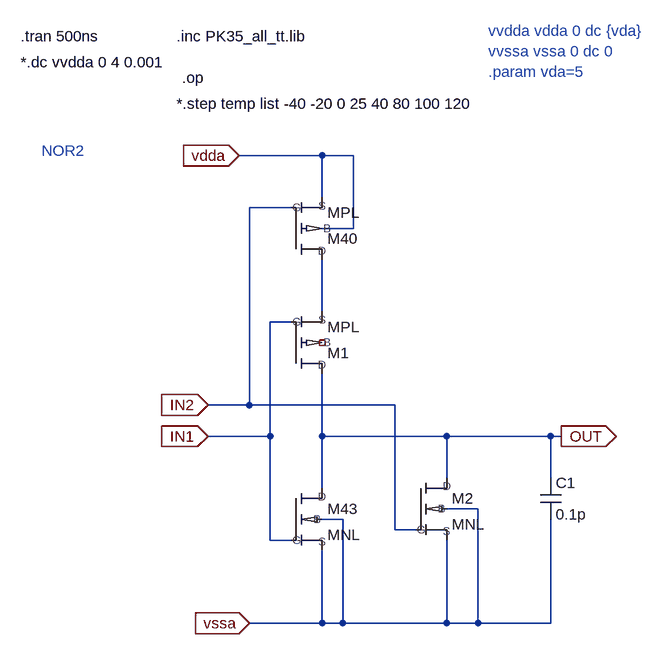
[diagram p0: schematic S_NOR2.asc]
S_NOR2.asc, the LTspice schematic file:
Version 4
SHEET 1 5948 5172
WIRE 896 -1344 768 -1344
WIRE 944 -1344 896 -1344
WIRE 896 -1280 896 -1344
WIRE 848 -1264 784 -1264
WIRE 944 -1232 944 -1344
WIRE 944 -1232 896 -1232
WIRE 896 -1104 896 -1184
WIRE 848 -1088 816 -1088
WIRE 784 -960 784 -1264
WIRE 784 -960 720 -960
WIRE 1008 -960 784 -960
WIRE 816 -912 816 -1088
WIRE 816 -912 720 -912
WIRE 896 -912 896 -1008
WIRE 1088 -912 896 -912
WIRE 1248 -912 1088 -912
WIRE 1264 -912 1248 -912
WIRE 1088 -848 1088 -912
WIRE 1248 -848 1248 -912
WIRE 896 -832 896 -912
WIRE 1136 -800 1088 -800
WIRE 928 -784 896 -784
WIRE 1008 -768 1008 -960
WIRE 1040 -768 1008 -768
WIRE 816 -752 816 -912
WIRE 848 -752 816 -752
WIRE 896 -624 896 -736
WIRE 896 -624 784 -624
WIRE 928 -624 928 -784
WIRE 928 -624 896 -624
WIRE 1088 -624 1088 -752
WIRE 1088 -624 928 -624
WIRE 1136 -624 1136 -800
WIRE 1136 -624 1088 -624
WIRE 1248 -624 1248 -784
WIRE 1248 -624 1136 -624
FLAG 768 -1344 vdda
IOPIN 768 -1344 In
FLAG 784 -624 vssa
IOPIN 784 -624 In
FLAG 720 -912 IN1
IOPIN 720 -912 In
FLAG 1264 -912 OUT
IOPIN 1264 -912 Out
FLAG 720 -960 IN2
IOPIN 720 -960 In
SYMBOL MPL 880 -1232 M180
SYMATTR InstName M40
SYMATTR SpiceLine l=0.8u w=6.6u pd=w+l+l ps=pd ad=w*l as=ad m=1
SYMBOL MNL 880 -784 R0
SYMATTR InstName M43
SYMATTR SpiceLine l=0.8u w=3.3u pd=w+l+l ps=pd ad=w*l as=ad m=1
SYMBOL cap 1232 -848 R0
SYMATTR InstName C1
SYMATTR Value 0.1p
SYMBOL MPL 880 -1056 M180
SYMATTR InstName M1
SYMATTR SpiceLine l=0.8u w=6.6u pd=w+l+l ps=pd ad=w*l as=ad m=1
SYMBOL MNL 1072 -800 R0
SYMATTR InstName M2
SYMATTR SpiceLine l=0.8u w=3.3u pd=w+l+l ps=pd ad=w*l as=ad m=1
TEXT 1152 -1536 Left 2 ;vvdda vdda 0 dc {vda}\nvvssa vssa 0 dc 0\n.param vda=5
TEXT 432 -1488 Left 2 !*.dc vvdda 0 4 0.001
TEXT 672 -1424 Left 2 !*.step temp list -40 -20 0 25 40 80 100 120
TEXT 680 -1464 Left 2 !.op
TEXT 672 -1528 Left 2 !.inc PK35_all_tt.lib
TEXT 432 -1528 Left 2 !.tran 500ns
TEXT 464 -1352 Left 2 ;NOR2

The netlist it stands for:
* S_NOR2.asc
XM40 N001 IN2 vdda vdda MPL l=0.8u w=6.6u pd=w+l+l ps=pd ad=w*l as=ad m=1  ; pins D G S B
XM43 OUT IN1 vssa vssa MNL l=0.8u w=3.3u pd=w+l+l ps=pd ad=w*l as=ad m=1  ; pins D G S B
C1 OUT vssa 0.1p
XM1 OUT IN1 N001 NC_01 MPL l=0.8u w=6.6u pd=w+l+l ps=pd ad=w*l as=ad m=1  ; pins D G S B
XM2 OUT IN2 vssa vssa MNL l=0.8u w=3.3u pd=w+l+l ps=pd ad=w*l as=ad m=1  ; pins D G S B
* vvdda vdda 0 dc {vda}
* vvssa vssa 0 dc 0
* .param vda=5
*.dc vvdda 0 4 0.001
*.step temp list -40 -20 0 25 40 80 100 120
.op
.inc PK35_all_tt.lib
.tran 500ns
* NOR2
.backanno
.end